# EAGLE schematic main_v2 (EAGLE 7.2.0)
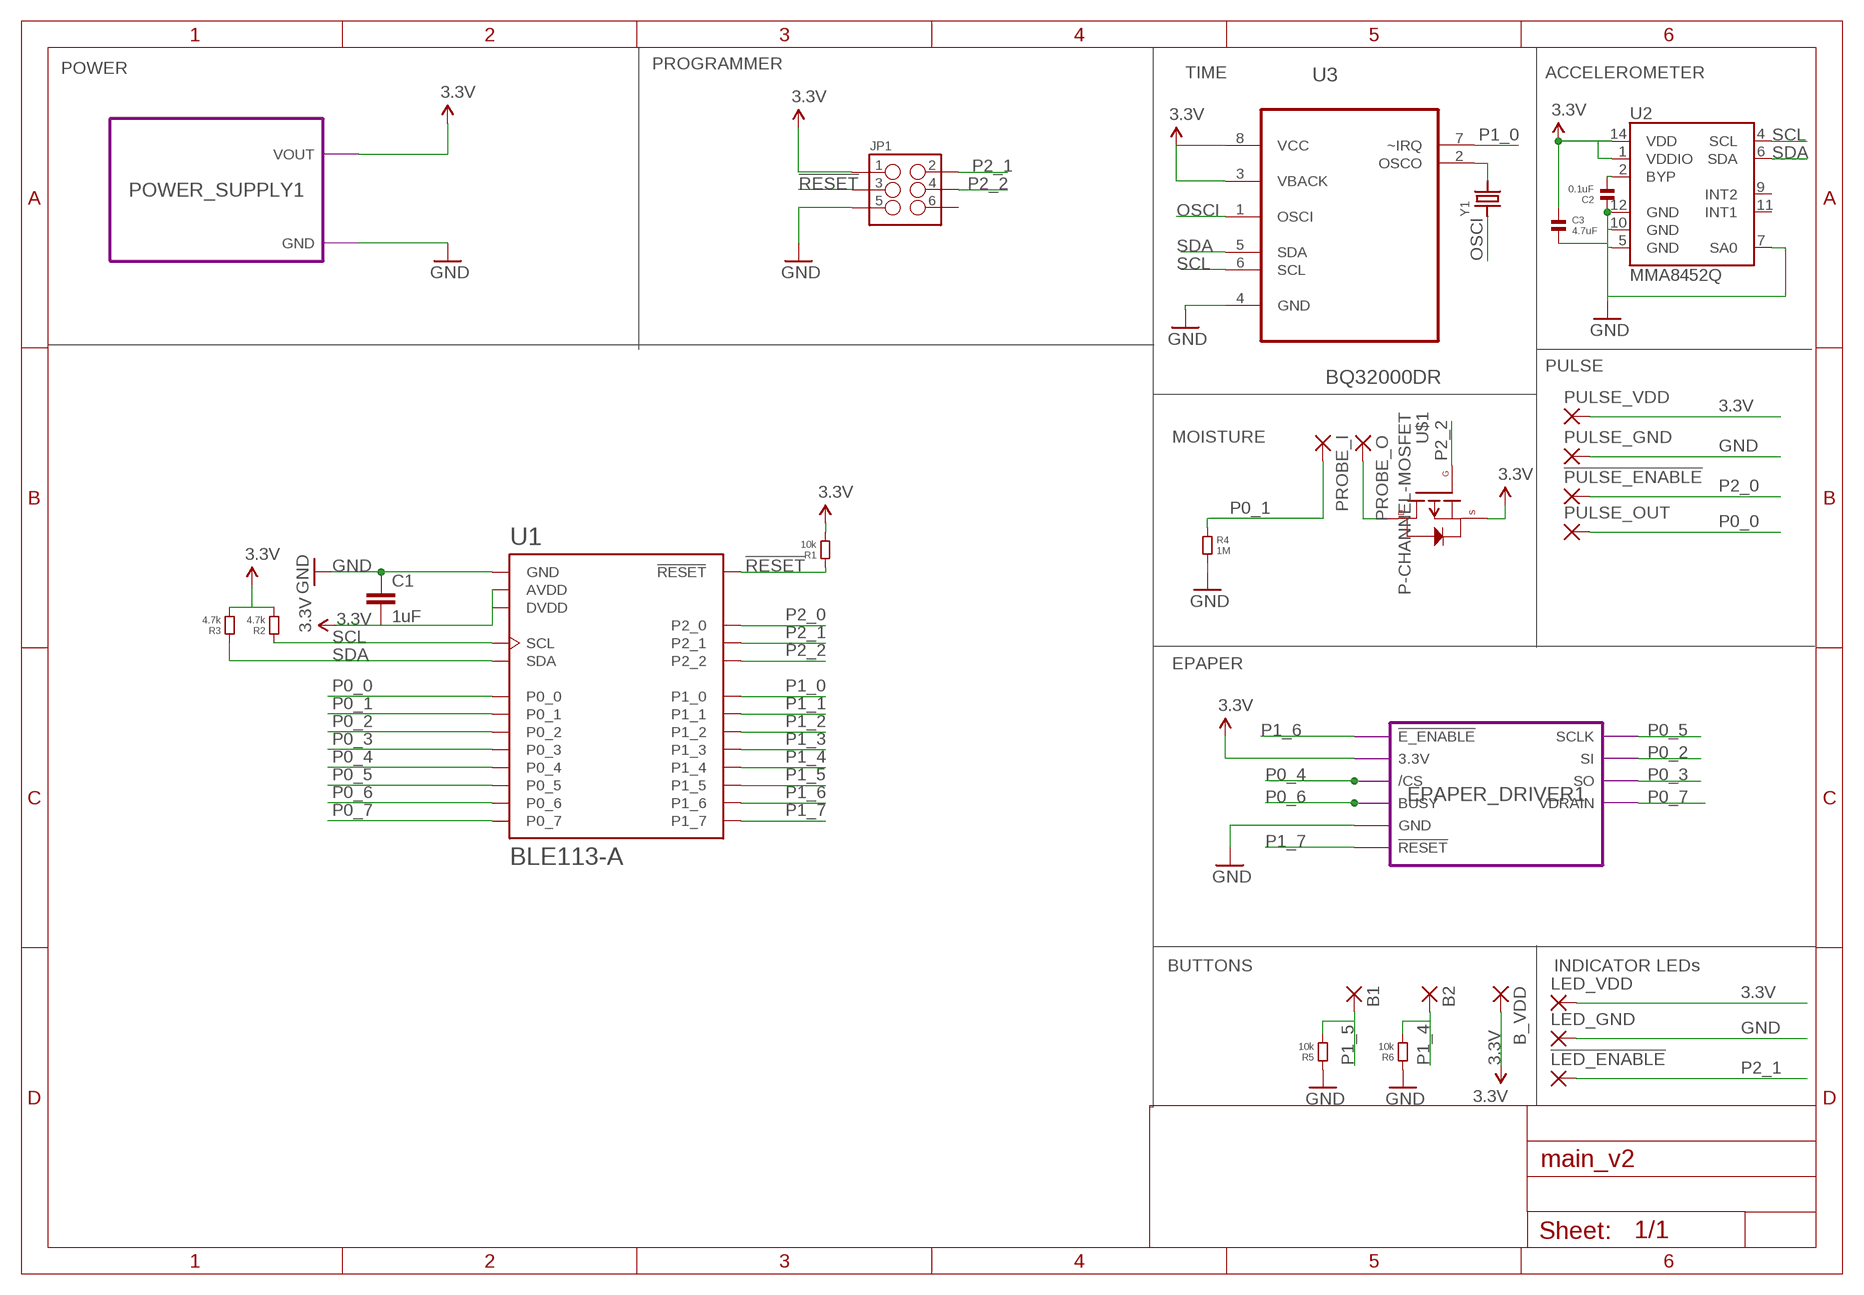
[diagram p0: schematic, sheet 1]

## Parts
!LED_ENABLE  SMD2  [SMD1,27-2,54]
!PULSE_ENABLE  SMD2  [SMD1,27-2,54]
B1  SMD2  [SMD1,27-2,54]
B2  SMD2  [SMD1,27-2,54]
B_VDD  SMD2  [SMD1,27-2,54]
C1  1uF  CAP0603-CAP  [0603-CAP]
C2  0.1uF  CAPACITOR.0402  [0402]
C3  4.7uF  CAPACITOR.0402  [0402]
JP1  M03X2POGO_PINS  [2X3_POGO]
LED_GND  SMD2  [SMD1,27-2,54]
LED_VDD  SMD2  [SMD1,27-2,54]
PROBE_I  SMD2  [SMD1,27-2,54]
PROBE_O  SMD2  [SMD1,27-2,54]
PULSE_GND  SMD2  [SMD1,27-2,54]
PULSE_OUT  SMD2  [SMD1,27-2,54]
PULSE_VDD  SMD2  [SMD1,27-2,54]
R1  10k  RESISTOR.0402  [0402]
R2  4.7k  RESISTOR.0402  [0402]
R3  4.7k  RESISTOR.0402  [0402]
R4  1M  RESISTOR.0402  [0402]
R5  10k  RESISTOR.0402  [0402]
R6  10k  RESISTOR.0402  [0402]
U1  BLE113-A  [BLE113-A]
U2  MMA8452Q  [QFN-16_0.5MM]
U3  BQ32000DR  [SOIC127P600X175-8N]
U$1  P-CHANNEL-MOSFET  [SOT23-3]
Y1  CRYSTAL32.768  [CRYSTAL_CYL_2X6MM_SMT]

## Module instances
POWER_SUPPLY1 = POWER_SUPPLY
EPAPER_DRIVER1 = EPAPER_DRIVER

## Nets
3.3V: B_VDD.1(P) C1.2 C3.1 JP1.P$1 LED_VDD.1(P) PULSE_VDD.1(P) R1.2 R2.2 R3.2 U1.AVDD U1.DVDD U2.1(VDDIO) U2.14(VDD) U3.3(VBACK) U3.8(VCC) U$1.2(S) ; port POWER_SUPPLY1.VOUT EPAPER_DRIVER1.3.3V
!RESET: JP1.P$3 R1.1 U1.RESET
GND: C1.1 C2.1 C3.2 JP1.P$5 LED_GND.1(P) PULSE_GND.1(P) R4.2 R5.1 R6.1 U1.GND U1.GND@2(GND) U1.GND@3(GND) U1.GND@4(GND) U1.GND@5(GND) U1.GND@6(GND) U1.GND@7(GND) U1.GND@8(GND) U1.GND@9(GND) U1.GND@10(GND) U2.5(GND) U2.7(SA0) U2.10(GND) U2.12(GND) U3.4(GND) ; port POWER_SUPPLY1.GND EPAPER_DRIVER1.GND
N$1: U3.2(OSCO) Y1.2
N$2: C2.2 U2.2(BYP)
N$3: PROBE_O.1(P) U$1.3(D)
OSCI: U3.1(OSCI) Y1.1
P0_0: PULSE_OUT.1(P) U1.P0_0
P0_1: PROBE_I.1(P) R4.1 U1.P0_1
P0_2: U1.P0_2 ; port EPAPER_DRIVER1.SI
P0_3: U1.P0_3 ; port EPAPER_DRIVER1.SO
P0_4: U1.P0_4 ; port EPAPER_DRIVER1./CS
P0_5: U1.P0_5 ; port EPAPER_DRIVER1.SCLK
P0_6: U1.P0_6 ; port EPAPER_DRIVER1.BUSY
P0_7: U1.P0_7 ; port EPAPER_DRIVER1.VDRAIN
P1_0: U1.P1_0 U3.7(~IRQ)
P1_1: U1.P1_1
P1_2: U1.P1_2
P1_3: U1.P1_3
P1_4: B2.1(P) R6.2 U1.P1_4
P1_5: B1.1(P) R5.2 U1.P1_5
P1_6: U1.P1_6 ; port EPAPER_DRIVER1.!E_ENABLE
P1_7: U1.P1_7 ; port EPAPER_DRIVER1.!RESET
P2_0: !PULSE_ENABLE.1(P) U1.P2_0
P2_1: !LED_ENABLE.1(P) JP1.P$2 U1.P2_1
P2_2: JP1.P$4 U1.P2_2 U$1.1(G)
SCL: R2.1 U1.SCL U2.4(SCL) U3.6(SCL)
SDA: R3.1 U1.SDA U2.6(SDA) U3.5(SDA)
Unconnected: JP1.P$6 U2.9(INT2) U2.11(INT1)

## Notes on the sheet
- POWER | PROGRAMMER
- TIME | ACCELEROMETER
- PULSE
- MOISTURE
- EPAPER
- BUTTONS | INDICATOR LEDs

## Library data of the parts
!LED_ENABLE !PULSE_ENABLE B1 B2 B_VDD LED_GND LED_VDD PROBE_I PROBE_O PULSE_GND PULSE_OUT PULSE_VDD = wirepad:SMD2: SMD PAD
C1 = SparkFun-Passives:CAP: Capacitor Standard 0603 ceramic capacitor, and 0.1" leaded capacitor.
C2 C3 = standardparts:CAPACITOR
JP1 = SparkFun-Connectors:M03X2: 2x3 .1" header. Shrouded, with keying- CONN-10681 SMT- CONN-11415 Pogo pins- HW-11044; PROD_ID: HW-11044
R1-R6 = standardparts:RESISTOR
U1 = sf-bluegiga:BLE113: Bluetooth Low Energy single-mode module - Bluetooth 4.0 (CC2541). BLE113-A variant has an on-module ceramic chip antenna. BLE113-A variant includes keepout/restrict area. Antenna edge of the module should be flush up against the edge of the PCB. See datasheet for variant layout details. The BLE113 is a Bluetooth Smart module targeted for small and low-power sensors and accessories. It integrates all features required for a Bluetooth Smart application, including Bluetooth radio, software stack, and GATT-based profiles. The BLE113 Bluetooth Smart module can also host end-user applications, which means no external micro controller is required in size or price constrained devices. Moreover, it has flexible hardware interfaces to connect to different peripherals and sensors and can be powered directly from a standard 3V coin cell battery or a pair of AAA batteries. In the lowest power sleep mode it merely consumes 500 nA and will wake up within a few hundred microseconds. The BLE113 Bluetooth Smart module conusmer approximately 30% less power and is smaller than the BLE112 Bluetooth Smart Module. http://www.bluegiga.com/en-US/products/bluetooth-4.0-modules/ble113-bluetooth--smart-module https://github.com/jrowberg/sf-oshw Last updated 2014-01-04 by Jeff Rowberg <jeff@rowberg.net>; ANTENNA: On-module ceramic chip antenna
U2 = SparkFun-Sensors:MMA8452Q: MMA8452Q 3-Axis, 12/8-bit Digital Accelerometer Supply Voltage: 1.6-3.6V Range: +/- 2g, 4g, 8g Interface: I2C, 12-bit and 8-bit ODR: 1.56 Hz - 800 Hz Package: QFN-16 http://cache.freescale.com/files/sensors/doc/data_sheet/MMA8452Q.pdf; PROD_ID: IC-10769
U3 = Texas Instruments_By_element14_Batch_1:BQ32000DR: REAL-TIME CLOCK (RTC); MPN: BQ32000DR; OC_FARNELL: 1754773; OC_NEWARK: 24R9067; PACKAGE: SOIC-8; SUPPLIER: TEXAS INSTRUMENTS
U$1 = GeekAmmo:P-CHANNEL-MOSFET: P-Channel MOSFET Mode Field Effect Transistor
Y1 = microbuilder:CRYSTAL: Crystals HC49UP - Surface Mount Crystal 4.0MHz 18pF +/-30ppm Surface Mount Crystal [Digikey: 535-9857-1-ND] 12.0 MHz Surface Mount Crystal [Digikey: 535-9869-6-ND] 25.0 MHz Surface Mount Crystal [Digikey: 535-9078-1-ND] 2.5 x 2.0mm - MEMs SMT Crystal 16.0 MHz 10pF 20ppm 2.5 x 2.0mm Crystal [Digikey -40-85°C: 535-10923-1-ND] 3.2 x 2.5mm - MEMs SMT Crystal 12.0 MHz 8pF 15ppm 3.2 x 2.5mm Crystal [Digikey: -10-70°C: 644-1047-1-ND -40-125°C: 644-1128-1-ND] 16.0 MHz 8pF 15ppm 3.2 x 2.5mm Crystal [Digikey: -10-70°C: 644-1049-1-ND -40-125°C: 644-1129-2-ND] 16.0 MHz 10pF 10ppm 3.2 x 2.5mm Crystal [Digikey: 644-1100-1-ND] 27.12 MHz 18pF 30ppm 3.2 x 2.5mm Crystal [Digikey: 887-1424-1-ND] 27.12MHz 10pF 10ppm 3.2 x 2.5mm Crystal [Digikey: 887-1329-1-ND] 4.9 x 1.8mm - MEMs SMT Crystal 32.768 KHz 12.5pF 20ppm 4.9 x 1.8mm Crystal [Digikey: SE2415CT-ND] 8.0 x 3.8mm - Surface Mount Crystal 32.768kHz 12.5pF 20ppm -40°C-85°C [Digikey: 535-9166-2-ND] Cylinder 32.768KHz Cylinder Crystal (2x6mm body) [Ex. Digikey: 300-8341-2-ND]

## Module POWER_SUPPLY
Ports: VOUT(io) GND(io)
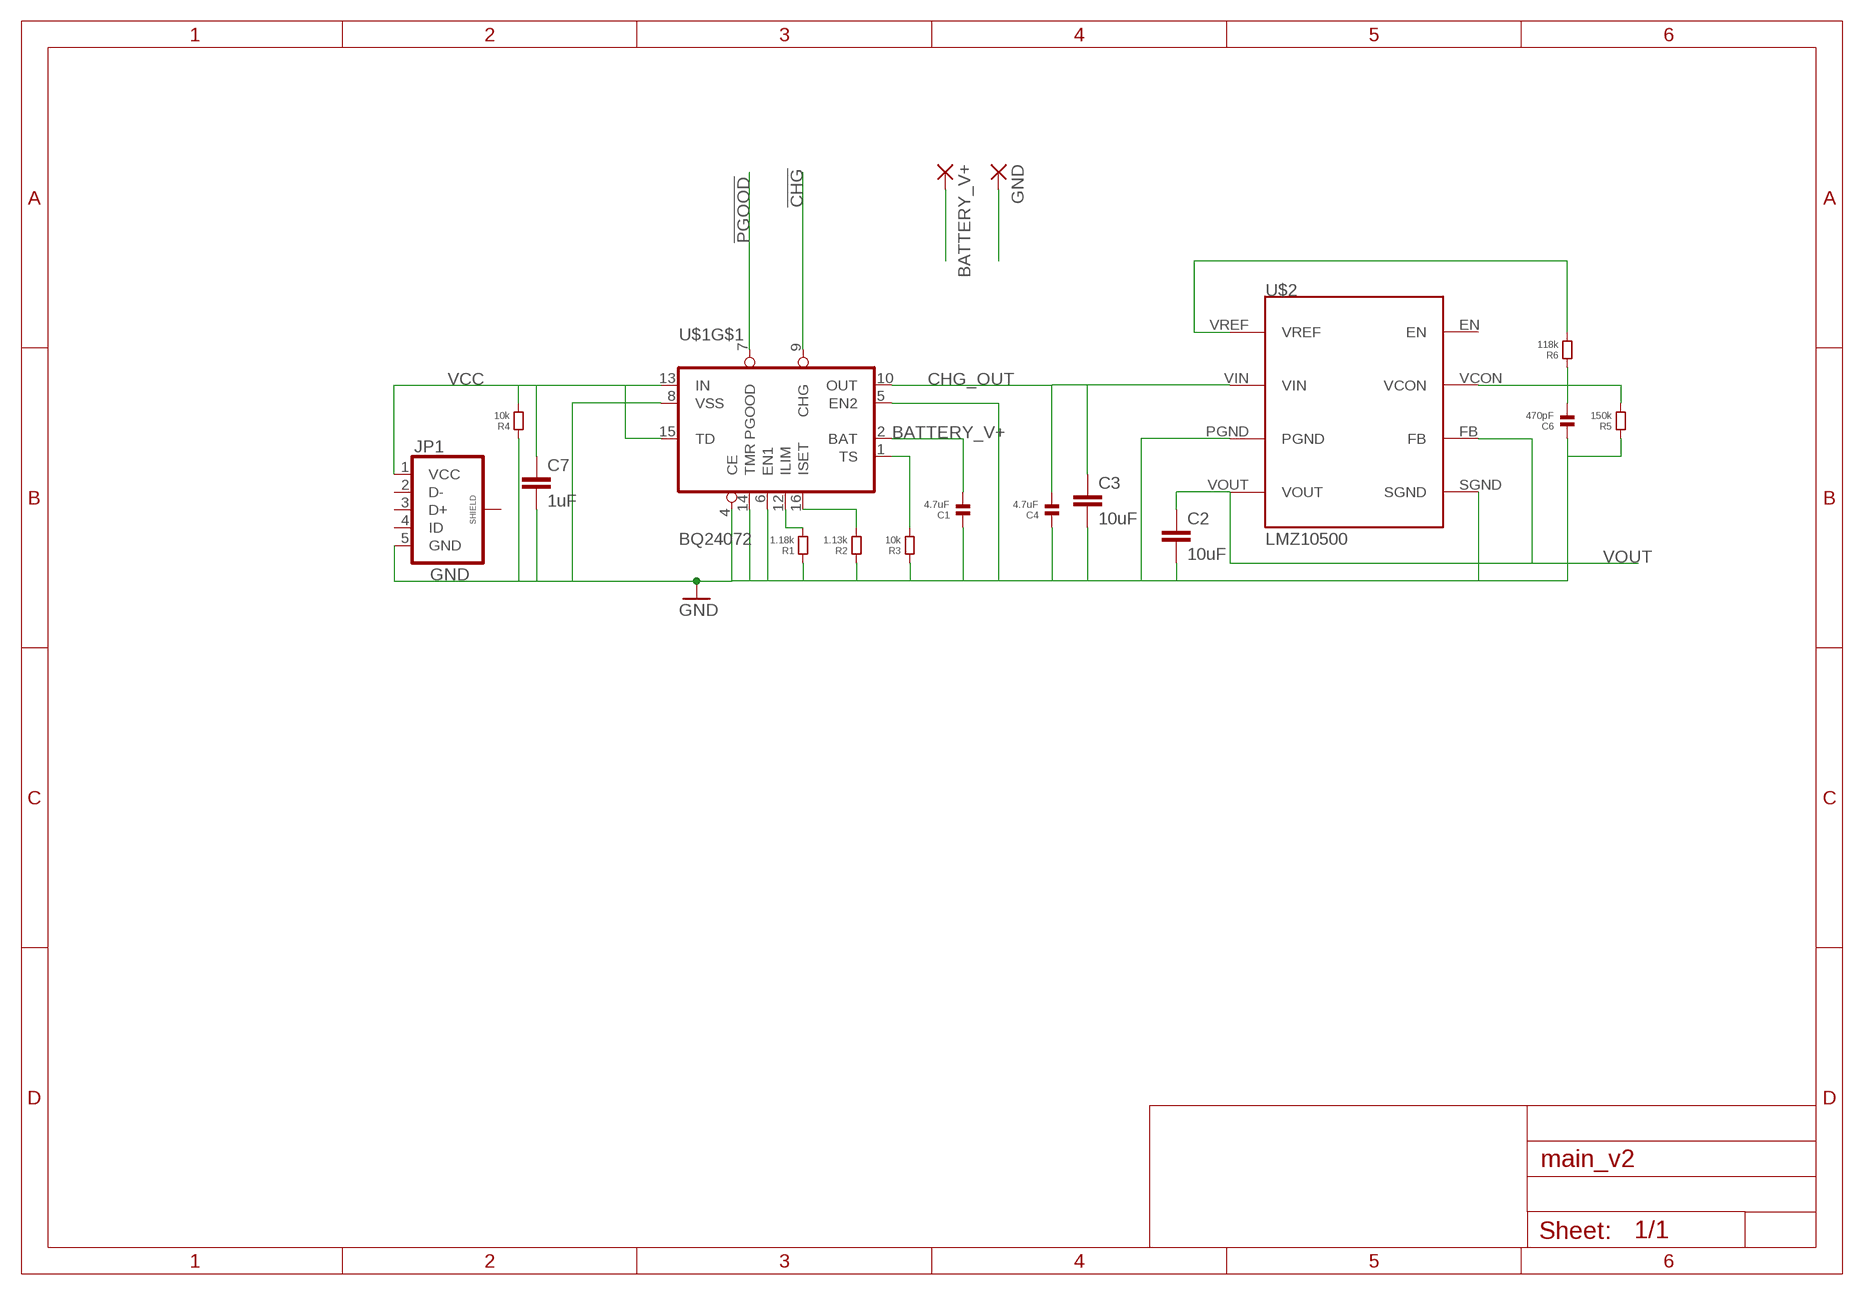
[diagram p1: schematic, module POWER_SUPPLY, sheet 1]

### Parts
BATTERY_V+  SMD2  [SMD1,27-2,54]
C1  4.7uF  CAPACITOR.0402  [0402]
C2  10uF  CAP0805  [0805]
C3  10uF  CAP0805  [0805]
C4  4.7uF  CAPACITOR.0402  [0402]
C6  470pF  CAPACITOR.0402  [0402]
C7  1uF  CAP0603-CAP  [0603-CAP]
GND  SMD2  [SMD1,27-2,54]
JP1  USB_MICROB_PLUG-SMT  [MICRO-B-SMT]
R1  1.18k  RESISTOR.0402  [0402]
R2  1.13k  RESISTOR.0402  [0402]
R3  10k  RESISTOR.0402  [0402]
R4  10k  RESISTOR.0402  [0402]
R5  150k  RESISTOR.0402  [0402]
R6  118k  RESISTOR.0402  [0402]
U$1  BQ24072  [S-PVQFN-N16]
U$2  LMZ10500  [LMZ10500]

### Nets
!CHG: U$1.9(CHG)
!PGOOD: U$1.7(PGOOD)
BATTERY_V+: BATTERY_V+.1(P) C1.2 U$1.2(BAT)
CHG_OUT: C3.1 C4.2 U$1.10(OUT) U$2.VIN
GND: C1.1 C2.2 C3.2 C4.1 C6.1 C7.2 GND.1(P) JP1.5(GND) R1.1 R2.1 R3.1 R4.1 R5.1 U$1.4(CE) U$1.5(EN2) U$1.6(EN1) U$1.8(VSS) U$1.14(TMR) U$2.PGND U$2.SGND
N$1: C6.2 R5.2 R6.1 U$2.VCON
N$2: R6.2 U$2.VREF
N$3: R2.2 U$1.16(ISET)
N$5: R1.2 U$1.12(ILIM)
N$7: R3.2 U$1.1(TS)
VCC: C7.1 JP1.1(VCC) R4.2 U$1.13(IN) U$1.15(TD)
VOUT: C2.1 U$2.FB U$2.VOUT
Unconnected: JP1.2(D-) JP1.3(D+) JP1.4(ID) JP1.P$6(SHIELD) U$1.TH(TH:TH) U$2.EN

### Library data of the parts
BATTERY_V+ GND = wirepad:SMD2: SMD PAD
C1 C4 C6 = standardparts:CAPACITOR
C2 C3 C7 = SparkFun-Passives:CAP: Capacitor Standard 0603 ceramic capacitor, and 0.1" leaded capacitor.
JP1 = SparkFun-Connectors:USB_MICROB_PLUG: USB Micro-B connectors Some male, some female. Watch your step!; PROD_ID: CONN-09900
R1-R6 = standardparts:RESISTOR
U$1 = Simplex-ICs:BQ24072: TI BQ24072 - Li battery charger and power path management ic
U$2 = LMZ10500:LMZ10500

## Module EPAPER_DRIVER
Ports: !E_ENABLE(io) 3.3V(io) /CS(io) BUSY(io) GND(io) !RESET(io) SCLK(io) SI(io) SO(io) VDRAIN(io)
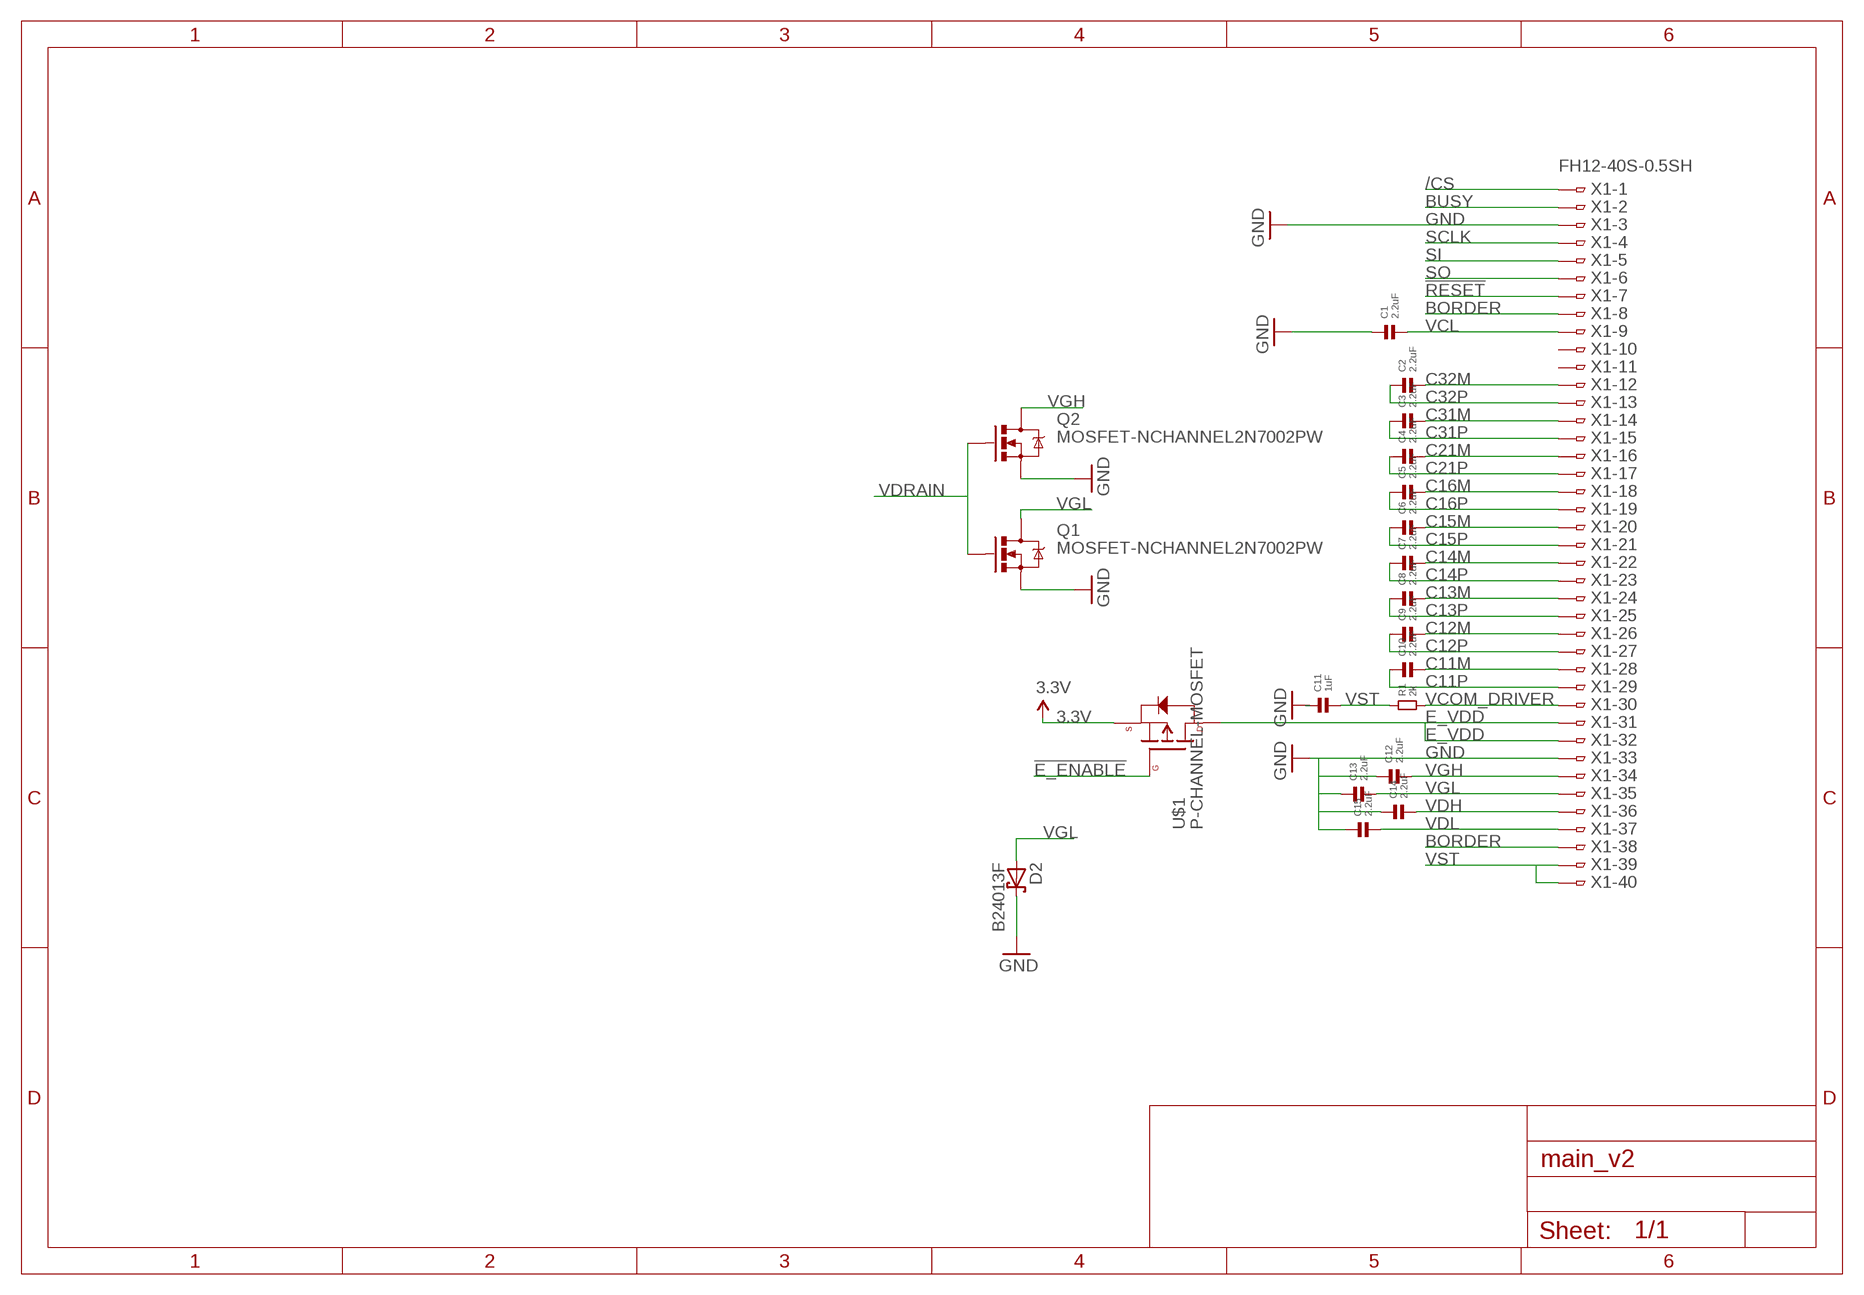
[diagram p2: schematic, module EPAPER_DRIVER, sheet 1]

### Parts
C1  2.2uF  CAPACITOR.0402  [0402]
C2  2.2uF  CAPACITOR.0402  [0402]
C3  2.2uF  CAPACITOR.0402  [0402]
C4  2.2uF  CAPACITOR.0402  [0402]
C5  2.2uF  CAPACITOR.0402  [0402]
C6  2.2uF  CAPACITOR.0402  [0402]
C7  2.2uF  CAPACITOR.0402  [0402]
C8  2.2uF  CAPACITOR.0402  [0402]
C9  2.2uF  CAPACITOR.0402  [0402]
C10  2.2uF  CAPACITOR.0402  [0402]
C11  1uF  CAPACITOR.0402  [0402]
C12  2.2uF  CAPACITOR.0402  [0402]
C13  2.2uF  CAPACITOR.0402  [0402]
C14  2.2uF  CAPACITOR.0402  [0402]
C15  2.2uF  CAPACITOR.0402  [0402]
D2  B24013F  SCHOTTKY-DIODESMD  [SMB]
Q1  MOSFET-NCHANNEL2N7002PW  [SOT323]
Q2  MOSFET-NCHANNEL2N7002PW  [SOT323]
R1  2k  RESISTOR.0402  [0402]
U$1  P-CHANNEL-MOSFET  [SOT23-3]
X1  FH12-40S-0.5SH  [FH12-40S-0.5SH]

### Nets
3.3V: U$1.2(S)
!E_ENABLE: U$1.1(G)
!RESET: X1.7
/CS: X1.1
BORDER: X1.8 X1.38
BUSY: X1.2
C11M: C10.2 X1.28
C11P: C10.1 X1.29
C12M: C9.2 X1.26
C12P: C9.1 X1.27
C13M: C8.2 X1.24
C13P: C8.1 X1.25
C14M: C7.2 X1.22
C14P: C7.1 X1.23
C15M: C6.2 X1.20
C15P: C6.1 X1.21
C16M: C5.2 X1.18
C16P: C5.1 X1.19
C21M: C4.2 X1.16
C21P: C4.1 X1.17
C31M: C3.2 X1.14
C31P: C3.1 X1.15
C32M: C2.2 X1.12
C32P: C2.1 X1.13
E_VDD: U$1.3(D) X1.31 X1.32
GND: C1.1 C11.1 C12.1 C13.1 C14.1 C15.1 D2.C Q1.2(S) Q2.2(S) X1.3 X1.33
SCLK: X1.4
SI: X1.5
SO: X1.6
VCL: C1.2 X1.9
VCOM_DRIVER: R1.2 X1.30
VDH: C14.2 X1.36
VDL: C15.2 X1.37
VDRAIN: Q1.1(G) Q2.1(G)
VGH: C12.2 Q2.3(D) X1.34
VGL: C13.2 D2.A Q1.3(D) X1.35
VST: C11.2 R1.1 X1.39 X1.40
Unconnected: X1.10 X1.11

### Library data of the parts
C1-C15 = standardparts:CAPACITOR
D2 = diode:SCHOTTKY-DIODE: Schottky Diode
Q1 Q2 = SparkFun-DiscreteSemi:MOSFET-NCHANNEL: Common NMOSFET Parts MFG P/N Store ID Prod ID FDD8780 TRANS-09984 SI7820DN TRANS-11055 FDS6630A IC-08089 2N7002PW TRANS-11151 FQP30N06L COM-10213 TRANS-10060 BSS123LT1G TRANS-08345 BSS138 TRANS-00830 BS170 2N7000; PROD_ID: TRANS-11151
R1 = standardparts:RESISTOR
U$1 = GeekAmmo:P-CHANNEL-MOSFET: P-Channel MOSFET Mode Field Effect Transistor
X1 = con-hirose:FH12-40S-0.5S: 0.5mm Pitch Connectors For FPC/FFC Source: Data sheet <http://www.hirose.co.jp/cataloge_hp/e58605370.pdf>; MPN: FH12-40S-0.5SH(55); OC_FARNELL: 1324556; OC_NEWARK: 34M6178